# Altium schematic sheet Shift Register Test Board.SchDoc
size C; SheetNumber: 1; SheetTotal: 1
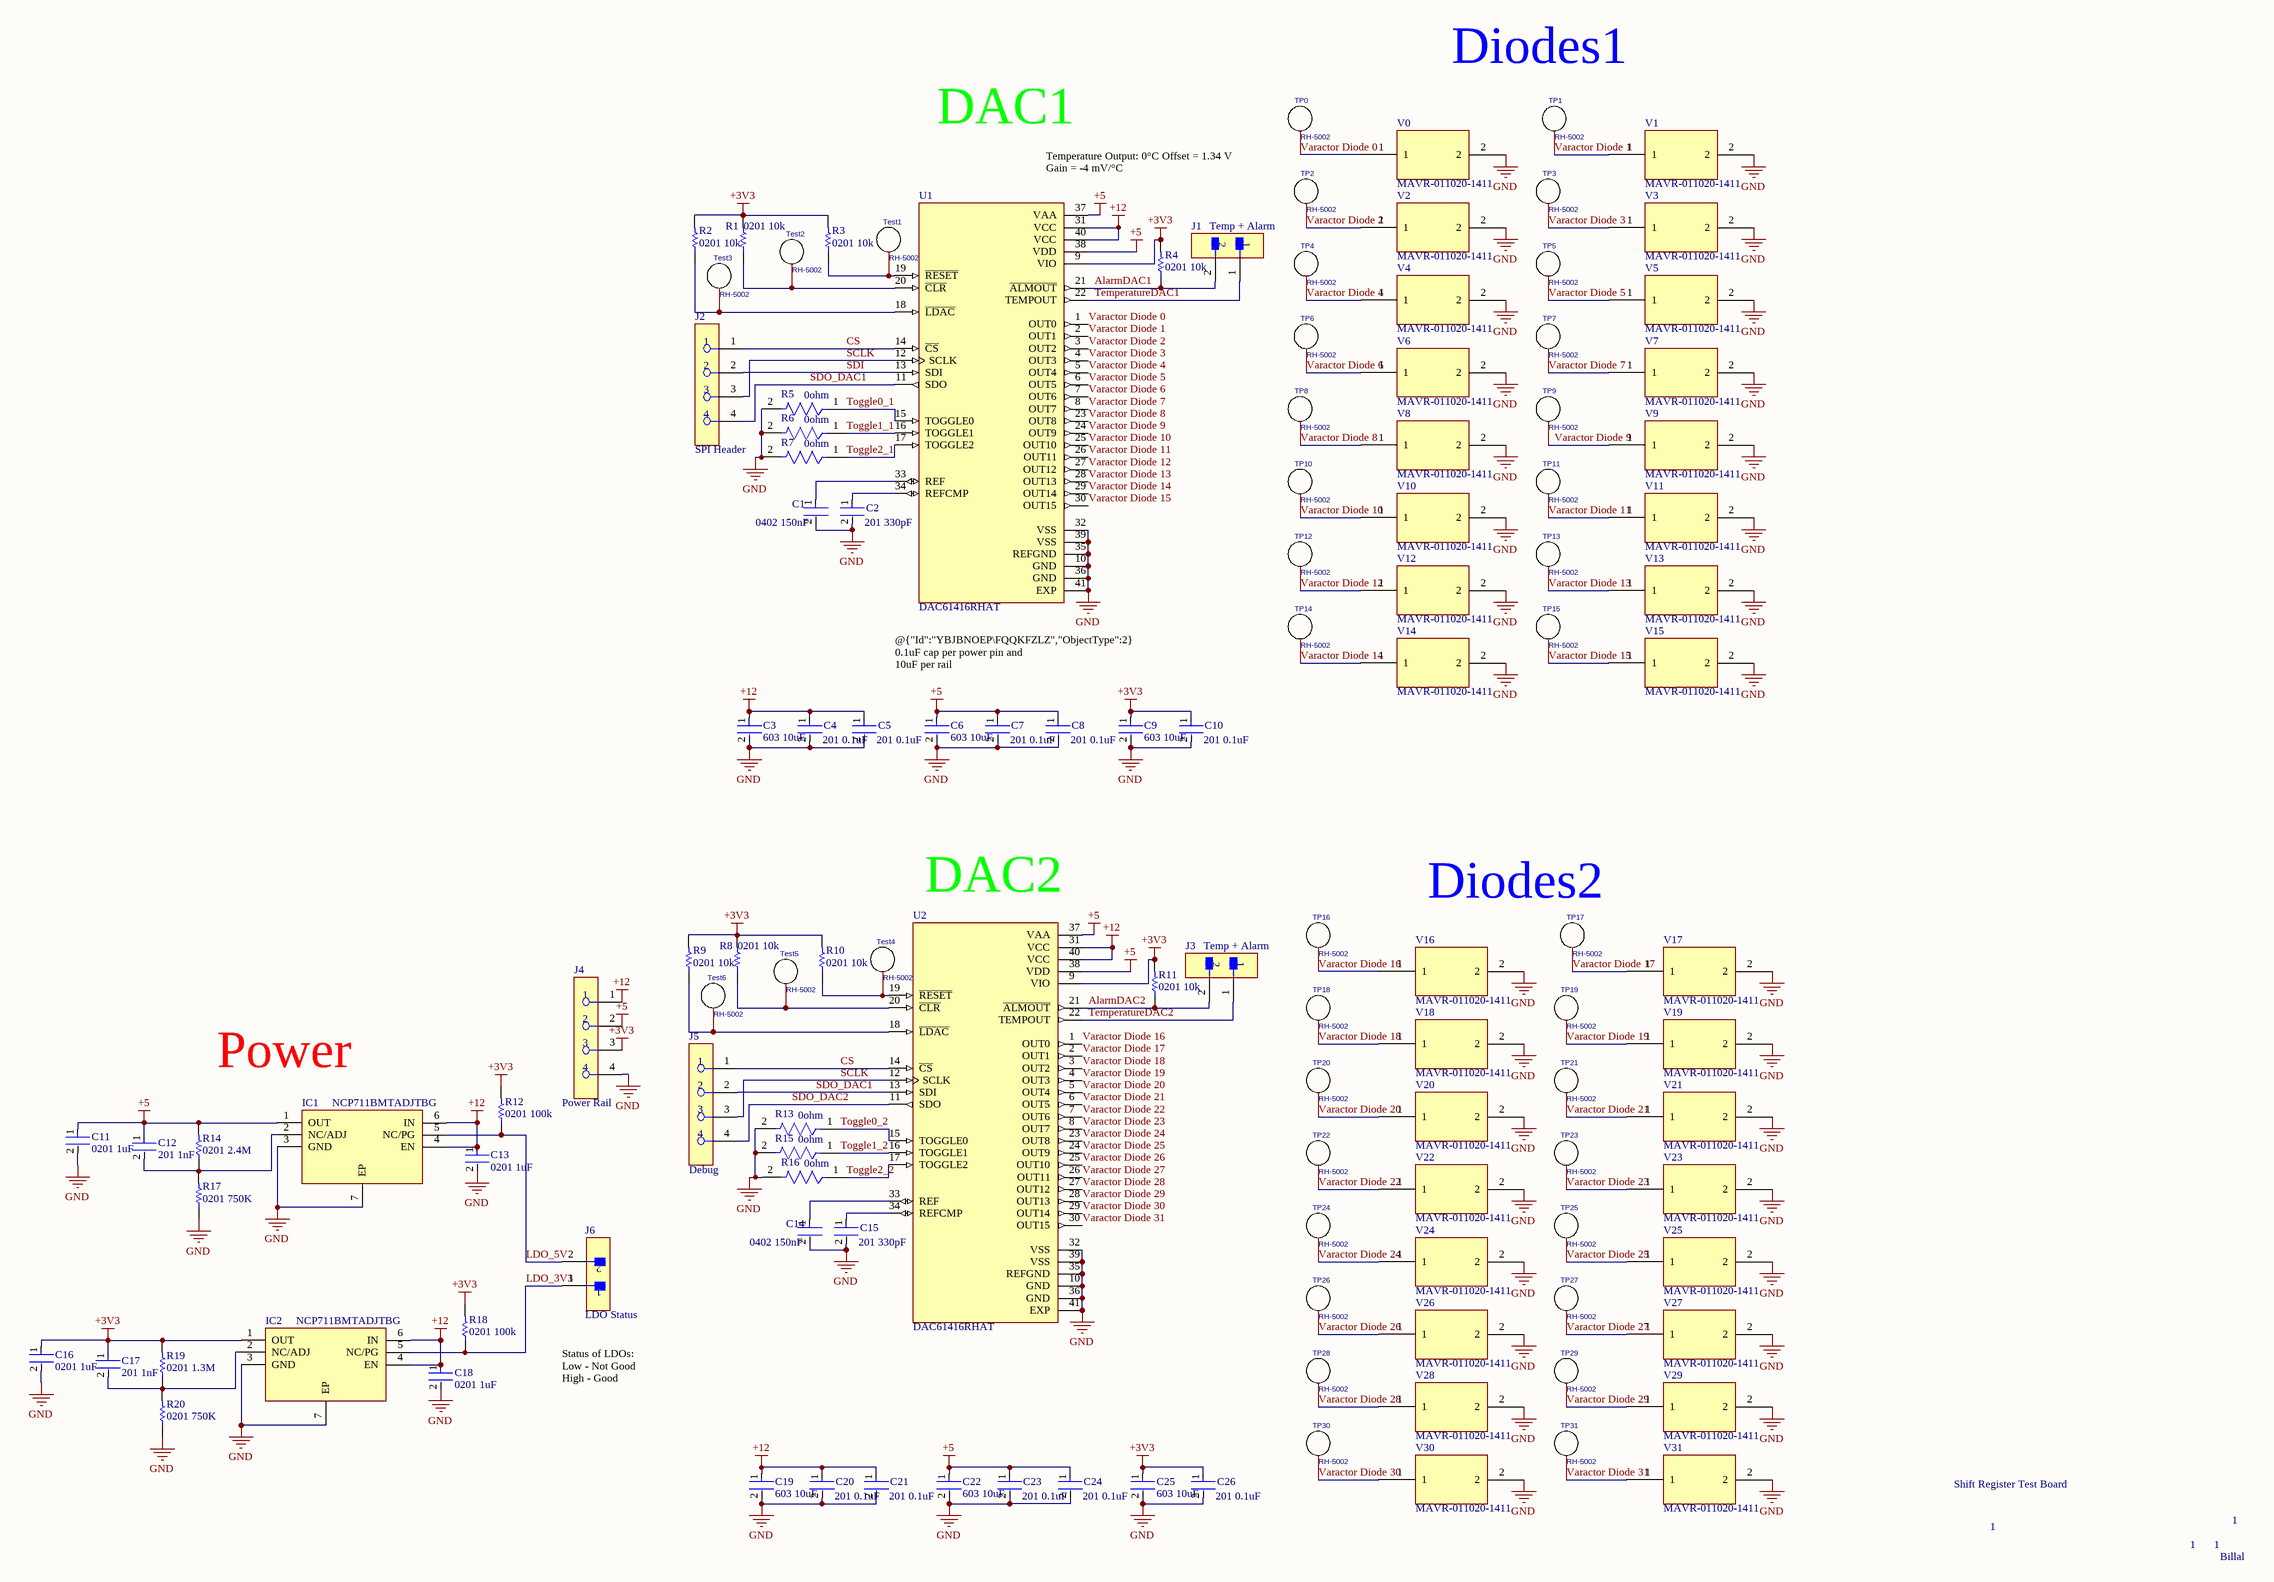
[diagram p0: Shift Register Test Board.SchDoc]

## Parts
C1  0402 150nF  [FP-GRM155-0_1-IPC_C]
C2  201 330pF  [FP-GRM033-0_09-IPC_A]
C3  603 10uF  [FP-C0603C106M8PACTU-MFG]
C4  201 0.1uF  [FP-GRM033-0_09-IPC_A]
C5  201 0.1uF  [FP-GRM033-0_09-IPC_A]
C6  603 10uF  [FP-C0603C106M8PACTU-MFG]
C7  201 0.1uF  [FP-GRM033-0_09-IPC_A]
C8  201 0.1uF  [FP-GRM033-0_09-IPC_A]
C9  603 10uF  [FP-C0603C106M8PACTU-MFG]
C10  201 0.1uF  [FP-GRM033-0_09-IPC_A]
C11  0201 1uF  [FP-GRM033-0_09-IPC_A]
C12  201 1nF  [FP-GRM033-0_09-IPC_A]
C13  0201 1uF  [FP-GRM033-0_09-IPC_A]
C14  0402 150nF  [FP-GRM155-0_1-IPC_C]
C15  201 330pF  [FP-GRM033-0_09-IPC_A]
C16  0201 1uF  [FP-GRM033-0_09-IPC_A]
C17  201 1nF  [FP-GRM033-0_09-IPC_A]
C18  0201 1uF  [FP-GRM033-0_09-IPC_A]
C19  603 10uF  [FP-C0603C106M8PACTU-MFG]
C20  201 0.1uF  [FP-GRM033-0_09-IPC_A]
C21  201 0.1uF  [FP-GRM033-0_09-IPC_A]
C22  603 10uF  [FP-C0603C106M8PACTU-MFG]
C23  201 0.1uF  [FP-GRM033-0_09-IPC_A]
C24  201 0.1uF  [FP-GRM033-0_09-IPC_A]
C25  603 10uF  [FP-C0603C106M8PACTU-MFG]
C26  201 0.1uF  [FP-GRM033-0_09-IPC_A]
IC1  NCP711BMTADJTBG  [SON65P200X200X80-7N]
IC2  NCP711BMTADJTBG  [SON65P200X200X80-7N]
J1  Temp + Alarm  [FP-TSW-102-12-T-S-MFG]
J2  SPI Header  [FP-315-43-104-41-003000-MFG]
J3  Temp + Alarm  [FP-TSW-102-12-T-S-MFG]
J4  Power Rail  [FP-315-43-104-41-003000-MFG]
J5  Debug  [FP-315-43-104-41-003000-MFG]
J6  LDO Status  [FP-TSW-102-12-T-S-MFG]
R1  0201 10k  [RESC0603X26X15LL03T05]
R2  0201 10k  [RESC0603X26X15LL03T05]
R3  0201 10k  [RESC0603X26X15LL03T05]
R4  0201 10k  [RESC0603X26X15LL03T05]
R5  0ohm  [FP-HCJ1206-MFG]
R6  0ohm  [FP-HCJ1206-MFG]
R7  0ohm  [FP-HCJ1206-MFG]
R8  0201 10k  [RESC0603X26X15LL03T05]
R9  0201 10k  [RESC0603X26X15LL03T05]
R10  0201 10k  [RESC0603X26X15LL03T05]
R11  0201 10k  [RESC0603X26X15LL03T05]
R12  0201 100k  [RESC0603X26X15LL03T05]
R13  0ohm  [FP-HCJ1206-MFG]
R14  0201 2.4M  [RESC0603X26X15LL03T05]
R15  0ohm  [FP-HCJ1206-MFG]
R16  0ohm  [FP-HCJ1206-MFG]
R17  0201 750K  [RESC0603X26X15LL03T05]
R18  0201 100k  [RESC0603X26X15LL03T05]
R19  0201 1.3M  [RESC0603X26X15LL03T05]
R20  0201 750K  [RESC0603X26X15LL03T05]
Test1  RH-5002  [TESTPOINT-TH_BD2.5-D1.2_RH-5002]
Test2  RH-5002  [TESTPOINT-TH_BD2.5-D1.2_RH-5002]
Test3  RH-5002  [TESTPOINT-TH_BD2.5-D1.2_RH-5002]
Test4  RH-5002  [TESTPOINT-TH_BD2.5-D1.2_RH-5002]
Test5  RH-5002  [TESTPOINT-TH_BD2.5-D1.2_RH-5002]
Test6  RH-5002  [TESTPOINT-TH_BD2.5-D1.2_RH-5002]
TP0  RH-5002  [TESTPOINT-TH_BD2.5-D1.2_RH-5002]
TP1  RH-5002  [TESTPOINT-TH_BD2.5-D1.2_RH-5002]
TP2  RH-5002  [TESTPOINT-TH_BD2.5-D1.2_RH-5002]
TP3  RH-5002  [TESTPOINT-TH_BD2.5-D1.2_RH-5002]
TP4  RH-5002  [TESTPOINT-TH_BD2.5-D1.2_RH-5002]
TP5  RH-5002  [TESTPOINT-TH_BD2.5-D1.2_RH-5002]
TP6  RH-5002  [TESTPOINT-TH_BD2.5-D1.2_RH-5002]
TP7  RH-5002  [TESTPOINT-TH_BD2.5-D1.2_RH-5002]
TP8  RH-5002  [TESTPOINT-TH_BD2.5-D1.2_RH-5002]
TP9  RH-5002  [TESTPOINT-TH_BD2.5-D1.2_RH-5002]
TP10  RH-5002  [TESTPOINT-TH_BD2.5-D1.2_RH-5002]
TP11  RH-5002  [TESTPOINT-TH_BD2.5-D1.2_RH-5002]
TP12  RH-5002  [TESTPOINT-TH_BD2.5-D1.2_RH-5002]
TP13  RH-5002  [TESTPOINT-TH_BD2.5-D1.2_RH-5002]
TP14  RH-5002  [TESTPOINT-TH_BD2.5-D1.2_RH-5002]
TP15  RH-5002  [TESTPOINT-TH_BD2.5-D1.2_RH-5002]
TP16  RH-5002  [TESTPOINT-TH_BD2.5-D1.2_RH-5002]
TP17  RH-5002  [TESTPOINT-TH_BD2.5-D1.2_RH-5002]
TP18  RH-5002  [TESTPOINT-TH_BD2.5-D1.2_RH-5002]
TP19  RH-5002  [TESTPOINT-TH_BD2.5-D1.2_RH-5002]
TP20  RH-5002  [TESTPOINT-TH_BD2.5-D1.2_RH-5002]
TP21  RH-5002  [TESTPOINT-TH_BD2.5-D1.2_RH-5002]
TP22  RH-5002  [TESTPOINT-TH_BD2.5-D1.2_RH-5002]
TP23  RH-5002  [TESTPOINT-TH_BD2.5-D1.2_RH-5002]
TP24  RH-5002  [TESTPOINT-TH_BD2.5-D1.2_RH-5002]
TP25  RH-5002  [TESTPOINT-TH_BD2.5-D1.2_RH-5002]
TP26  RH-5002  [TESTPOINT-TH_BD2.5-D1.2_RH-5002]
TP27  RH-5002  [TESTPOINT-TH_BD2.5-D1.2_RH-5002]
TP28  RH-5002  [TESTPOINT-TH_BD2.5-D1.2_RH-5002]
TP29  RH-5002  [TESTPOINT-TH_BD2.5-D1.2_RH-5002]
TP30  RH-5002  [TESTPOINT-TH_BD2.5-D1.2_RH-5002]
TP31  RH-5002  [TESTPOINT-TH_BD2.5-D1.2_RH-5002]
U1  DAC61416RHAT  [DAC61416RHAT]
U2  DAC61416RHAT  [DAC61416RHAT]
V0  MAVR-011020-1411  [MAVR-011020-1411]
V1  MAVR-011020-1411  [MAVR-011020-1411]
V2  MAVR-011020-1411  [MAVR-011020-1411]
V3  MAVR-011020-1411  [MAVR-011020-1411]
V4  MAVR-011020-1411  [MAVR-011020-1411]
V5  MAVR-011020-1411  [MAVR-011020-1411]
V6  MAVR-011020-1411  [MAVR-011020-1411]
V7  MAVR-011020-1411  [MAVR-011020-1411]
V8  MAVR-011020-1411  [MAVR-011020-1411]
V9  MAVR-011020-1411  [MAVR-011020-1411]
V10  MAVR-011020-1411  [MAVR-011020-1411]
V11  MAVR-011020-1411  [MAVR-011020-1411]
V12  MAVR-011020-1411  [MAVR-011020-1411]
V13  MAVR-011020-1411  [MAVR-011020-1411]
V14  MAVR-011020-1411  [MAVR-011020-1411]
V15  MAVR-011020-1411  [MAVR-011020-1411]
V16  MAVR-011020-1411  [MAVR-011020-1411]
V17  MAVR-011020-1411  [MAVR-011020-1411]
V18  MAVR-011020-1411  [MAVR-011020-1411]
V19  MAVR-011020-1411  [MAVR-011020-1411]
V20  MAVR-011020-1411  [MAVR-011020-1411]
V21  MAVR-011020-1411  [MAVR-011020-1411]
V22  MAVR-011020-1411  [MAVR-011020-1411]
V23  MAVR-011020-1411  [MAVR-011020-1411]
V24  MAVR-011020-1411  [MAVR-011020-1411]
V25  MAVR-011020-1411  [MAVR-011020-1411]
V26  MAVR-011020-1411  [MAVR-011020-1411]
V27  MAVR-011020-1411  [MAVR-011020-1411]
V28  MAVR-011020-1411  [MAVR-011020-1411]
V29  MAVR-011020-1411  [MAVR-011020-1411]
V30  MAVR-011020-1411  [MAVR-011020-1411]
V31  MAVR-011020-1411  [MAVR-011020-1411]

## Nets
+3V3: C9.1 C10.1 C16.1 C17.1 C25.1 C26.1 IC2.1(OUT) J4.3 R1.2 R2.2 R3.2 R4.2 R8.2 R9.2 R10.2 R11.2 R12.2 R18.2 R19.2 U1.9(VIO) U2.9(VIO)
+5: C6.1 C7.1 C8.1 C11.1 C12.1 C22.1 C23.1 C24.1 IC1.1(OUT) J4.2 R14.2 U1.37(VAA) U1.38(VDD) U2.37(VAA) U2.38(VDD)
+12: C3.1 C4.1 C5.1 C13.1 C18.1 C19.1 C20.1 C21.1 IC1.4(EN) IC1.6(IN) IC2.4(EN) IC2.6(IN) J4.1 U1.31(VCC) U1.40(VCC) U2.31(VCC) U2.40(VCC)
GND: C1.2 C2.2 C3.2 C4.2 C5.2 C6.2 C7.2 C8.2 C9.2 C10.2 C11.2 C13.2 C14.2 C15.2 C16.2 C18.2 C19.2 C20.2 C21.2 C22.2 C23.2 C24.2 C25.2 C26.2 IC1.3(GND) IC1.7(EP) IC2.3(GND) IC2.7(EP) J4.4 R5.2 R6.2 R7.2 R13.2 R15.2 R16.2 R17.1 R20.1 U1.10(GND) U1.32(VSS) U1.35(REFGND) U1.36(GND) U1.39(VSS) U1.41(EXP) U2.10(GND) U2.32(VSS) U2.35(REFGND) U2.36(GND) U2.39(VSS) U2.41(EXP) V0.2 V1.2 V2.2 V3.2 V4.2 V5.2 V6.2 V7.2 V8.2 V9.2 V10.2 V11.2 V12.2 V13.2 V14.2 V15.2 V16.2 V17.2 V18.2 V19.2 V20.2 V21.2 V22.2 V23.2 V24.2 V25.2 V26.2 V27.2 V28.2 V29.2 V30.2 V31.2
AlarmDAC1: J1.2 R4.1 U1.21(~{ALMOUT})
AlarmDAC2: J3.2 R11.1 U2.21(~{ALMOUT})
CS: J2.1 J5.1 U1.14(~{CS}) U2.14(~{CS})
LDO_3V3: IC2.5(NC/PG) J6.1 R18.1
LDO_5V: IC1.5(NC/PG) J6.2 R12.1
SCLK: J2.3 J5.3 U1.12(SCLK) U2.12(SCLK)
SDI: J2.2 U1.13(SDI)
SDO_DAC1: J2.4 J5.2 U1.11(SDO) U2.13(SDI)
SDO_DAC2: J5.4 U2.11(SDO)
TemperatureDAC1: J1.1 U1.22(TEMPOUT)
TemperatureDAC2: J3.1 U2.22(TEMPOUT)
Toggle0_1: R5.1 U1.15(TOGGLE0)
Toggle0_2: R13.1 U2.15(TOGGLE0)
Toggle1_1: R6.1 U1.16(TOGGLE1)
Toggle1_2: R15.1 U2.16(TOGGLE1)
Toggle2_1: R7.1 U1.17(TOGGLE2)
Toggle2_2: R16.1 U2.17(TOGGLE2)
Varactor Diode 0: TP0.1 U1.1(OUT0) V0.1
Varactor Diode 1: TP1.1 U1.2(OUT1) V1.1
Varactor Diode 2: TP2.1 U1.3(OUT2) V2.1
Varactor Diode 3: TP3.1 U1.4(OUT3) V3.1
Varactor Diode 4: TP4.1 U1.5(OUT4) V4.1
Varactor Diode 5: TP5.1 U1.6(OUT5) V5.1
Varactor Diode 6: TP6.1 U1.7(OUT6) V6.1
Varactor Diode 7: TP7.1 U1.8(OUT7) V7.1
Varactor Diode 8: TP8.1 U1.23(OUT8) V8.1
Varactor Diode 9: TP9.1 U1.24(OUT9) V9.1
Varactor Diode 10: TP10.1 U1.25(OUT10) V10.1
Varactor Diode 11: TP11.1 U1.26(OUT11) V11.1
Varactor Diode 12: TP12.1 U1.27(OUT12) V12.1
Varactor Diode 13: TP13.1 U1.28(OUT13) V13.1
Varactor Diode 14: TP14.1 U1.29(OUT14) V14.1
Varactor Diode 15: TP15.1 U1.30(OUT15) V15.1
Varactor Diode 16: TP16.1 U2.1(OUT0) V16.1
Varactor Diode 17: TP17.1 U2.2(OUT1) V17.1
Varactor Diode 18: TP18.1 U2.3(OUT2) V18.1
Varactor Diode 19: TP19.1 U2.4(OUT3) V19.1
Varactor Diode 20: TP20.1 U2.5(OUT4) V20.1
Varactor Diode 21: TP21.1 U2.6(OUT5) V21.1
Varactor Diode 22: TP22.1 U2.7(OUT6) V22.1
Varactor Diode 23: TP23.1 U2.8(OUT7) V23.1
Varactor Diode 24: TP24.1 U2.23(OUT8) V24.1
Varactor Diode 25: TP25.1 U2.24(OUT9) V25.1
Varactor Diode 26: TP26.1 U2.25(OUT10) V26.1
Varactor Diode 27: TP27.1 U2.26(OUT11) V27.1
Varactor Diode 28: TP28.1 U2.27(OUT12) V28.1
Varactor Diode 29: TP29.1 U2.28(OUT13) V29.1
Varactor Diode 30: TP30.1 U2.29(OUT14) V30.1
Varactor Diode 31: TP31.1 U2.30(OUT15) V31.1
NetC1_1: C1.1 U1.33(REF)
NetC2_1: C2.1 U1.34(REFCMP)
NetC12_2: C12.2 IC1.2(NC/ADJ) R14.1 R17.2
NetC14_1: C14.1 U2.33(REF)
NetC15_1: C15.1 U2.34(REFCMP)
NetC17_2: C17.2 IC2.2(NC/ADJ) R19.1 R20.2
NetR1_1: R1.1 Test2.1 U1.20(~{CLR})
NetR2_1: R2.1 Test3.1 U1.18(~{LDAC})
NetR3_1: R3.1 Test1.1 U1.19(~{RESET})
NetR8_1: R8.1 Test5.1 U2.20(~{CLR})
NetR9_1: R9.1 Test6.1 U2.18(~{LDAC})
NetR10_1: R10.1 Test4.1 U2.19(~{RESET})

## Notes on the sheet
- Diodes1
- DAC1
- (near U1) Temperature Output: 0°C Offset = 1.34 V Gain = -4 mV/°C
- @{"Id":"YBJBNOEP\FQQKFZLZ","ObjectType":2}
  0.1uF cap per power pin and 10uF per rail
- (near U2) DAC2
- (near TP17) Diodes2
- Power
- Status of LDOs:
  Low - Not Good
  High - Good
- Shift Register Test Board
- 1
- Billal

## Library data of the parts
C1 C14 = CMP-06035-040691-1: C5448879
C2 C15 = CMP-06035-000463-1: C3899460; Capacitance: 1uF; Voltage Rating: 6.3V; Tolerance: 20%; Packaging: Tape and Reel; Max Operating Temperature: 105°C; Case/Package: 0201; Min Operating Temperature: -55°C; Mount: Surface Mount
C3 C6 C9 C19 C22 C25 = CMP-03020-034654-1: C194427; RoHS Compliant: Yes
C4 C5 C7 C8 C10 C20 C21 C23 C24 C26 = CMP-06035-000463-1: C181043; Capacitance: 1uF; Voltage Rating: 6.3V; Tolerance: 20%; Packaging: Tape and Reel; Max Operating Temperature: 105°C; Case/Package: 0201; Min Operating Temperature: -55°C; Mount: Surface Mount
C11 C13 C16 C18 = CMP-06035-000463-1: C335102; Voltage Rating: 6.3V; Tolerance: 20%; Capacitance: 1uF; Packaging: Tape and Reel; Max Operating Temperature: 105°C; Case/Package: 0201; Min Operating Temperature: -55°C; Mount: Surface Mount
C12 C17 = CMP-06035-000463-1: C85934; Capacitance: 1uF; Voltage Rating: 6.3V; Tolerance: 20%; Packaging: Tape and Reel; Max Operating Temperature: 105°C; Case/Package: 0201; Min Operating Temperature: -55°C; Mount: Surface Mount
IC1 IC2 = NCP711BMTADJTBG: C893333; Manufacturer_Name: onsemi; Datasheet Link: https://www.onsemi.com/pub/Collateral/NCP711-D.PDF; Height: 0.8mm; Manufacturer_Part_Number: NCP711BMTADJTBG; Mouser Part Number: 863-NCP711BMTADJTBG; Mouser Price/Stock: https://www.mouser.co.uk/ProductDetail/onsemi/NCP711BMTADJTBG?qs=W%2FMpXkg%252BdQ46oCoLBtghiQ%3D%3D; Arrow Part Number: NCP711BMTADJTBG; Arrow Price/Stock: https://www.arrow.com/en/products/ncp711bmtadjtbg/on-semiconductor?region=nac
J1 J3 J6 = CMP-02766-001444-1: CONN HEADER VERT 2POS 2.54MM; Gender: Male; Number of Contacts: 2; RoHS Compliant: Yes; Mount: Through Hole; Termination: Solder; Packaging: Bulk; Contact Material: Bronze; Contact Plating: Tin; Number of Rows: 1; REACH SVHC: No SVHC; Pitch: 2.54mm; Radiation Hardening: No
J2 J4 J5 = CMP-00254-30991456-1: 315-43-104-41-003000 4 Position Receptacle Connector 0.100 (2.54mm) Through Hole Gold"; Number of Contacts: 4; Current Rating: 3A; Voltage Rating: 150V; Connector Type: Receptacle, Socket; Color: Black; Contact Material: Gold, Nickel; Contact Plating: Gold; Mount: Through Hole; RoHS: Compliant; Pitch: 2.54mm; Packaging: Bulk; Height: 2.667mm; Number of Positions: 4; Max Operating Temperature: 125°C; Min Operating Temperature: -55°C; Number of Rows: 1; Termination: Solder
R1-R4 R8-R11 = CMP-2004-03568-1: C106225; Manufacturer: TE Connectivity / AMP; Part Number: CRG0201F10K
R5-R7 R13 R15 R16 = CMP-26527-002752-1: C17888; Resistance: 0mR; Radiation Hardening: No; Features: Automotive AEC-Q200; RoHS Compliant: Yes; Height: 0.026inch; Case Code (Metric): 3216; Min Operating Temperature: -55°C; Number of Terminations: 2; Mount: Surface Mount; Case/Package: 1206; Termination: Wraparound; Length: 0.122inch; Packaging: Tape and Reel; Max Operating Temperature: 155°C; Case Code (Imperial): 1206; Package Quantity: 5000; Width: 0.061inch
R12 R18 = CMP-2004-03568-1: C106224; Manufacturer: TE Connectivity / AMP; Part Number: CRG0201F10K
R14 = CMP-2004-03568-1: C423649; Manufacturer: TE Connectivity / AMP; Part Number: CRG0201F10K
R17 R20 = CMP-2004-03568-1: C158358; Manufacturer: TE Connectivity / AMP; Part Number: CRG0201F10K
R19 = CMP-2004-03568-1: C307090; Manufacturer: TE Connectivity / AMP; Part Number: CRG0201F10K
Test1-Test6 TP0-TP31 = RH-5002: C5199802; Manufacturer: 荣和; Add into BOM: yes; Connector Type: Pin Type (Through-Board); Plastic Color: White; Board Space (Diameter φ/ Length x Width): 2.5mm; Symbol: RH-5002; Device: RH-5002; LCSC Part Name: PCB电路板测试点/测试针; Supplier Part: C5199802; Manufacturer Part: RH-5002; Supplier Footprint: -; JLCPCB Part Class: Extended Part; Datasheet: https://item.szlcsc.com/datasheet/RH-5002/5885638.html; Supplier: LCSC; Convert to PCB: yes